# Altium schematic sheet MCU.SchDoc
size A4; PageSetup: Record=PageOptions|CenterHorizontal=True|CenterVertical=True|PrintScale=0.98|XCorrection=1.00|YCorrection=1.00|PrintKind=0|BorderSize=5000000|LeftOffset=0|BottomOffset=0|Orientation=2|PaperLength=1000|PaperWidth=1000|Scale=100|PaperSource=7|PrintQuality=-4|MediaType=1|DitherType=10|PaperKind=A4 210x297 ºÁÃ×|PrintScaleMode=1
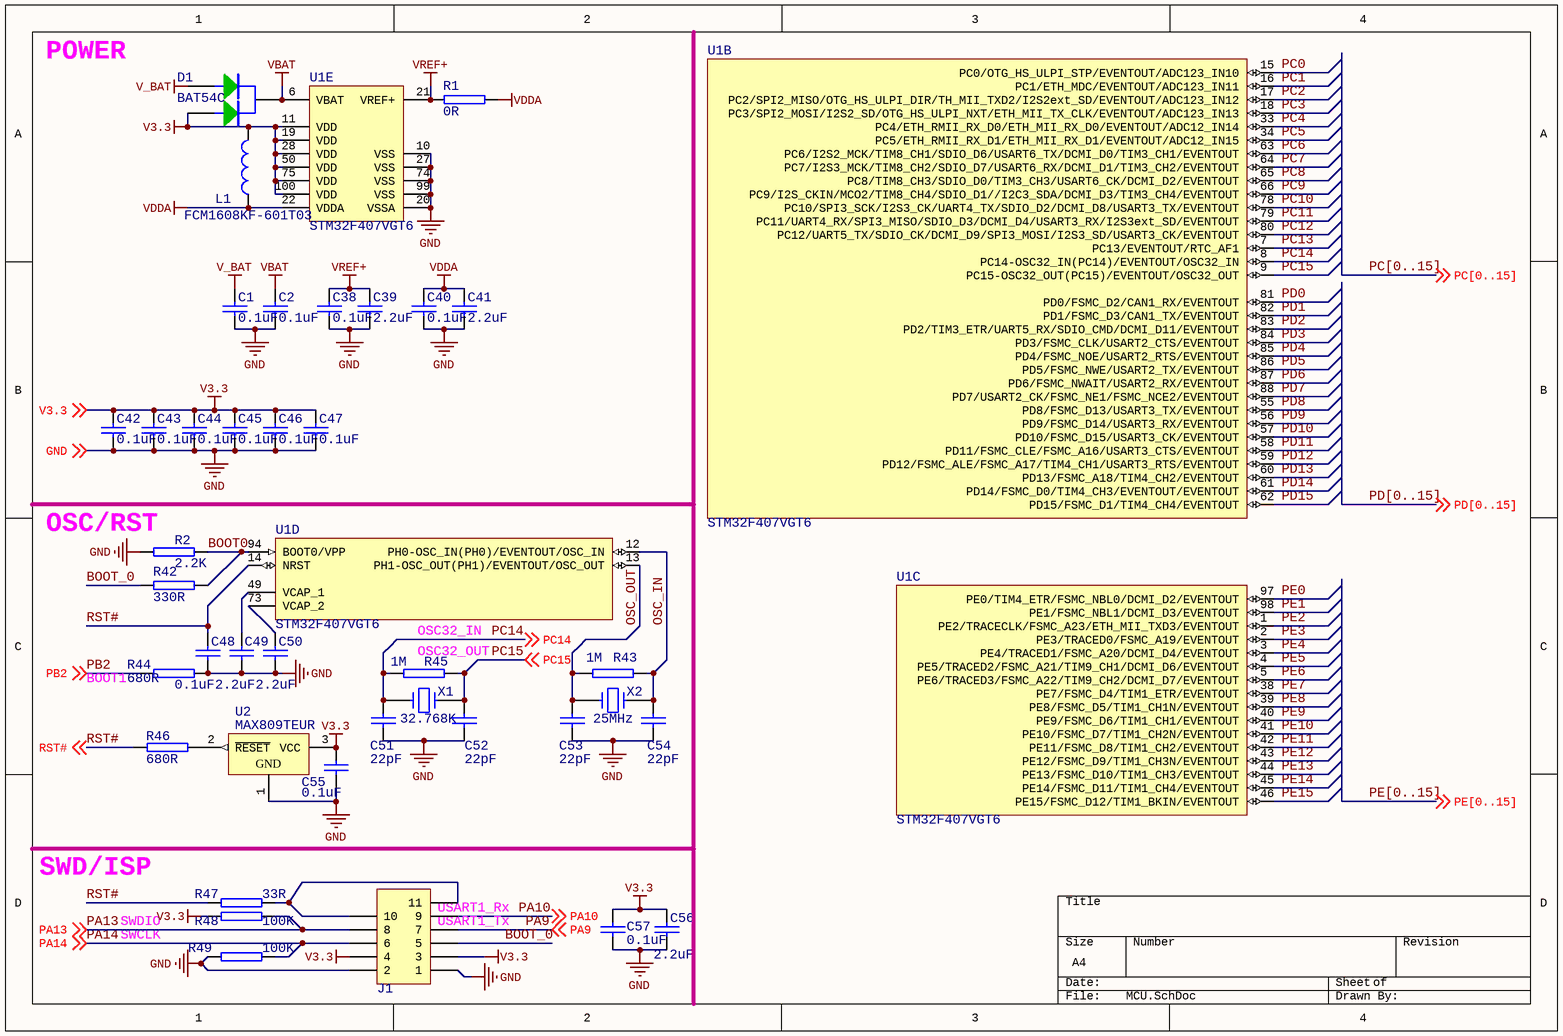
[diagram p0: MCU.SchDoc]

## Parts
C1  0.1uF  [C1608(0603)]
C2  0.1uF  [C1608(0603)]
C38  0.1uF  [C1608(0603)]
C39  2.2uF  [C1608(0603)]
C40  0.1uF  [C1608(0603)]
C41  2.2uF  [C1608(0603)]
C42  0.1uF  [C1608(0603)]
C43  0.1uF  [C1608(0603)]
C44  0.1uF  [C1608(0603)]
C45  0.1uF  [C1608(0603)]
C46  0.1uF  [C1608(0603)]
C47  0.1uF  [C1608(0603)]
C48  0.1uF  [C1608(0603)]
C49  2.2uF  [C1608(0603)]
C50  2.2uF  [C1608(0603)]
C51  22pF  [C1608(0603)]
C52  22pF  [C1608(0603)]
C53  22pF  [C1608(0603)]
C54  22pF  [C1608(0603)]
C55  0.1uF  [C1608(0603)]
C56  2.2uF  [C1608(0603)]
C57  0.1uF  [C1608(0603)]
D1  BAT54C  [SOT23-3_N]
J1  H2.54 6X2  [HDR2X6H]  (value not drawn)
L1  FCM1608KF-601T03  [R1608(0603)]
R1  0R  [R1608(0603)]
R2  2.2K  [R1608(0603)]
R42  330R  [R1608(0603)]
R43  1M  [R1608(0603)]
R44  680R  [R1608(0603)]
R45  1M  [R1608(0603)]
R46  680R  [R1608(0603)]
R47  33R  [R1608(0603)]
R48  100K  [R1608(0603)]
R49  100K  [R1608(0603)]
U1  STM32F407VGT6  [TQFP100_N]  (parts B,C,D,E of 5)
U2  MAX809TEUR  [SOT23-3_N]
X1  32.768K  [FC-135]
X2  25MHz  [XTAL-3225]

## Nets
GND: C1.2 C2.2 C38.2 C39.2 C40.2 C41.2 C42.2 C43.2 C44.2 C45.2 C46.2 C47.2 C48.2 C49.2 C50.2 C51.1 C52.1 C53.1 C54.1 C55.2 C56.2 C57.1 J1.1 J1.2 R2.2 R44.1 R49.1 U1.10(VSS) U1.20(VSSA) U1.27(VSS) U1.74(VSS) U1.99(VSS) U2.1(GND) ; off-sheet GND
V3.3: C42.1 C43.1 C44.1 C45.1 C46.1 C47.1 C55.1 C56.1 C57.2 D1.1 J1.3 J1.4 L1.2 R48.1 U1.11(VDD) U1.19(VDD) U1.28(VDD) U1.50(VDD) U1.75(VDD) U1.100(VDD) U2.3(VCC) ; off-sheet V3.3
V_BAT: C1.1 D1.2
VBAT: C2.1 D1.3 U1.6(VBAT)
VDDA: C40.1 C41.1 L1.1 R1.1 U1.22(VDDA)
VREF+: C38.1 C39.1 R1.2 U1.21(VREF+)
BOOT0: R2.1 R42.2 U1.94(BOOT0/VPP)
BOOT_0: J1.5 R42.1
OSC_IN: C54.2 R43.1 U1.12(PH0-OSC_IN(PH0)/EVENTOUT/OSC_IN) X2.1
OSC_OUT: C53.2 R43.2 U1.13(PH1-OSC_OUT(PH1)/EVENTOUT/OSC_OUT) X2.3
PA9: J1.7 ; off-sheet PA9
PA10: J1.9 ; off-sheet PA10
PA13: J1.8 R48.2 ; off-sheet PA13
PA14: J1.6 R49.2 ; off-sheet PA14
PB2: R44.2 ; off-sheet PB2
PC0: U1.15(PC0/OTG_HS_ULPI_STP/EVENTOUT/ADC123_IN10)
PC1: U1.16(PC1/ETH_MDC/EVENTOUT/ADC123_IN11)
PC2: U1.17(PC2/SPI2_MISO/OTG_HS_ULPI_DIR/TH_MII_TXD2/I2S2ext_SD/EVENTOUT/ADC123_IN12)
PC3: U1.18(PC3/SPI2_MOSI/I2S2_SD/OTG_HS_ULPI_NXT/ETH_MII_TX_CLK/EVENTOUT/ADC123_IN13)
PC4: U1.33(PC4/ETH_RMII_RX_D0/ETH_MII_RX_D0/EVENTOUT/ADC12_IN14)
PC5: U1.34(PC5/ETH_RMII_RX_D1/ETH_MII_RX_D1/EVENTOUT/ADC12_IN15)
PC6: U1.63(PC6/I2S2_MCK/TIM8_CH1/SDIO_D6/USART6_TX/DCMI_D0/TIM3_CH1/EVENTOUT)
PC7: U1.64(PC7/I2S3_MCK/TIM8_CH2/SDIO_D7/USART6_RX/DCMI_D1/TIM3_CH2/EVENTOUT)
PC8: U1.65(PC8/TIM8_CH3/SDIO_D0/TIM3_CH3/USART6_CK/DCMI_D2/EVENTOUT)
PC9: U1.66(PC9/I2S_CKIN/MCO2/TIM8_CH4/SDIO_D1//I2C3_SDA/DCMI_D3/TIM3_CH4/EVENTOUT)
PC10: U1.78(PC10/SPI3_SCK/I2S3_CK/UART4_TX/SDIO_D2/DCMI_D8/USART3_TX/EVENTOUT)
PC11: U1.79(PC11/UART4_RX/SPI3_MISO/SDIO_D3/DCMI_D4/USART3_RX/I2S3ext_SD/EVENTOUT)
PC12: U1.80(PC12/UART5_TX/SDIO_CK/DCMI_D9/SPI3_MOSI/I2S3_SD/USART3_CK/EVENTOUT)
PC13: U1.7(PC13/EVENTOUT/RTC_AF1)
PC14: C51.2 R45.2 U1.8(PC14-OSC32_IN(PC14)/EVENTOUT/OSC32_IN) X1.2 ; off-sheet PC14
PC15: C52.2 R45.1 U1.9(PC15-OSC32_OUT(PC15)/EVENTOUT/OSC32_OUT) X1.1 ; off-sheet PC15
PD0: U1.81(PD0/FSMC_D2/CAN1_RX/EVENTOUT)
PD1: U1.82(PD1/FSMC_D3/CAN1_TX/EVENTOUT)
PD2: U1.83(PD2/TIM3_ETR/UART5_RX/SDIO_CMD/DCMI_D11/EVENTOUT)
PD3: U1.84(PD3/FSMC_CLK/USART2_CTS/EVENTOUT)
PD4: U1.85(PD4/FSMC_NOE/USART2_RTS/EVENTOUT)
PD5: U1.86(PD5/FSMC_NWE/USART2_TX/EVENTOUT)
PD6: U1.87(PD6/FSMC_NWAIT/USART2_RX/EVENTOUT)
PD7: U1.88(PD7/USART2_CK/FSMC_NE1/FSMC_NCE2/EVENTOUT)
PD8: U1.55(PD8/FSMC_D13/USART3_TX/EVENTOUT)
PD9: U1.56(PD9/FSMC_D14/USART3_RX/EVENTOUT)
PD10: U1.57(PD10/FSMC_D15/USART3_CK/EVENTOUT)
PD11: U1.58(PD11/FSMC_CLE/FSMC_A16/USART3_CTS/EVENTOUT)
PD12: U1.59(PD12/FSMC_ALE/FSMC_A17/TIM4_CH1/USART3_RTS/EVENTOUT)
PD13: U1.60(PD13/FSMC_A18/TIM4_CH2/EVENTOUT)
PD14: U1.61(PD14/FSMC_D0/TIM4_CH3/EVENTOUT/EVENTOUT)
PD15: U1.62(PD15/FSMC_D1/TIM4_CH4/EVENTOUT)
PE0: U1.97(PE0/TIM4_ETR/FSMC_NBL0/DCMI_D2/EVENTOUT)
PE1: U1.98(PE1/FSMC_NBL1/DCMI_D3/EVENTOUT)
PE2: U1.1(PE2/TRACECLK/FSMC_A23/ETH_MII_TXD3/EVENTOUT)
PE3: U1.2(PE3/TRACED0/FSMC_A19/EVENTOUT)
PE4: U1.3(PE4/TRACED1/FSMC_A20/DCMI_D4/EVENTOUT)
PE5: U1.4(PE5/TRACED2/FSMC_A21/TIM9_CH1/DCMI_D6/EVENTOUT)
PE6: U1.5(PE6/TRACED3/FSMC_A22/TIM9_CH2/DCMI_D7/EVENTOUT)
PE7: U1.38(PE7/FSMC_D4/TIM1_ETR/EVENTOUT)
PE8: U1.39(PE8/FSMC_D5/TIM1_CH1N/EVENTOUT)
PE9: U1.40(PE9/FSMC_D6/TIM1_CH1/EVENTOUT)
PE10: U1.41(PE10/FSMC_D7/TIM1_CH2N/EVENTOUT)
PE11: U1.42(PE11/FSMC_D8/TIM1_CH2/EVENTOUT)
PE12: U1.43(PE12/FSMC_D9/TIM1_CH3N/EVENTOUT)
PE13: U1.44(PE13/FSMC_D10/TIM1_CH3/EVENTOUT)
PE14: U1.45(PE14/FSMC_D11/TIM1_CH4/EVENTOUT)
PE15: U1.46(PE15/FSMC_D12/TIM1_BKIN/EVENTOUT)
RST#: C48.1 R46.1 R47.2 U1.14(NRST) ; off-sheet RST#
NetC49_1: C49.1 U1.49(VCAP_1)
NetC50_1: C50.1 U1.73(VCAP_2)
NetJ1_10: J1.10 J1.11 R47.1
NetR46_2: R46.2 U2.2(~{RESET})

## Buses and harness runs
bus PC[0..15]
bus PD[0..15]
bus PE[0..15]

## Notes on the sheet
- POWER
- (near R2) OSC/RST
- (near U1) OSC32_IN
- (near R45) OSC32_OUT
- (near R44) BOOT1
- SWD/ISP
- SWDIO
- (near J1) USART1_Tx
- (near J1) USART1_Rx
- SWCLK

## Library data of the parts
C1 C2 C38-C57 = CAP: Capacitor
J1 = Header 6X2: Header, 6-Pin, Dual row; LatestRevisionDate: 17-Jul-2002; LatestRevisionNote: Re-released for DXP Platform.; Publisher: Altium Limited
L1 = Inductor: Code_IEC: 1005; Value: 10mH; Published: 8-Jun-2000; LatestRevisionDate: 29-May-2009; LatestRevisionNote: IPC-7351 Footprint Added.; PackageReference: 0402-A; Publisher: Altium Limited; PackageDescription: Chip Inductor; Code_JEITA: 0402
R1 R2 R42-R49 = R
U1 = STM32F407VGT6: ARM Cortex-M4 32b MCU+FPU, 210DMIP, 1024 kB Flash, 192+4 kB RAM, Camera, 82 I/Os, 100-pin LQFP, -40 to +85°C, Tray; Internal RAM: 192kB; Operating Frequency (Processor Speed): 168MHz; A/D Converter: 16x12-bit; D/A Converter: 2x12-bit; 16-bit Timers (IC/OC/PWM): 12x16-bit(24/24/30); 32-bit Timer (IC/OC/PWM): 2x32-bit (8/8/8); Other Timer Functions: 2xWDG, RTC, 24-bit down counter; Serial Interface: 3xSPI/2xI2S/2xI2C/3xUSART(IrDa, ISO7816)/3xUART/2xUSB OTG FS/HS, 2xCAN/Ethernet MAC10/100, SDIO; DatasheetVersion: rev2, Jan-2012; PackageVersion: 2012; PackageReference: LQFP100; PackageDescription: 100-Pin Low Profile Quad Flat Package, 14x14 mm Body, 0.5 mm Pitch; ComponentLink1Description: Manufacturer URL; ComponentLink1URL: http://www.st.com/; ComponentLink2Description: STM32F405/7 Datasheet; ComponentLink2URL: http://www.st.com/internet/com/TECHNICAL_RESOURCES/TECHNICAL_LITERATURE/DATASHEET/DM00037051.pdf; ComponentLink3Description: STM32F4 Web Page; ComponentLink3URL: http://www.st.com/internet/mcu/subclass/1521.jsp
U2 = MAX6520EUR-T: 3-Terminal, 1.2V Voltage Reference; Published: 16-Jan-2001; LatestRevisionDate: 29-May-2009; LatestRevisionNote: IPC-7351 Footprint Added.; DatasheetVersion: Sep-1996; PackageVersion: 1996; PackageReference: SOT23-3; Publisher: Altium Limited; PackageDescription: 3-Pin SOT-23 Package 0.95 mm Pitch, 2.3 mm Lead Span; ComponentLink1Description: Manufacturer Link; ComponentLink1URL: http://www.maxim-ic.com/; ComponentLink2Description: Datasheet; ComponentLink2URL: http://pdfserv.maxim-ic.com/en/ds/MAX6520.pdf
X1 X2 = CRYSTAL